# Altium schematic sheet CPU_JTAG_Power_PLL.SchDoc: CPU_JTAG_Power_PLL
size A4 portrait; Revision: 3.4; SheetNumber: 13; SheetTotal: 23; Date: 18/06/2014; DrawnBy: J. Gabriel R.E.; Organization: Seven Solutions S.L.; Address1: C/Baza, Parcela 19, Nave 3; Address2: Polнgono Ind. Juncaril; Address3: 18210-Peligros-Granada; Address4: Spain; WebAddress: www.sevensols.com; Project: White Rabbit; ProjectName: White Rabbit
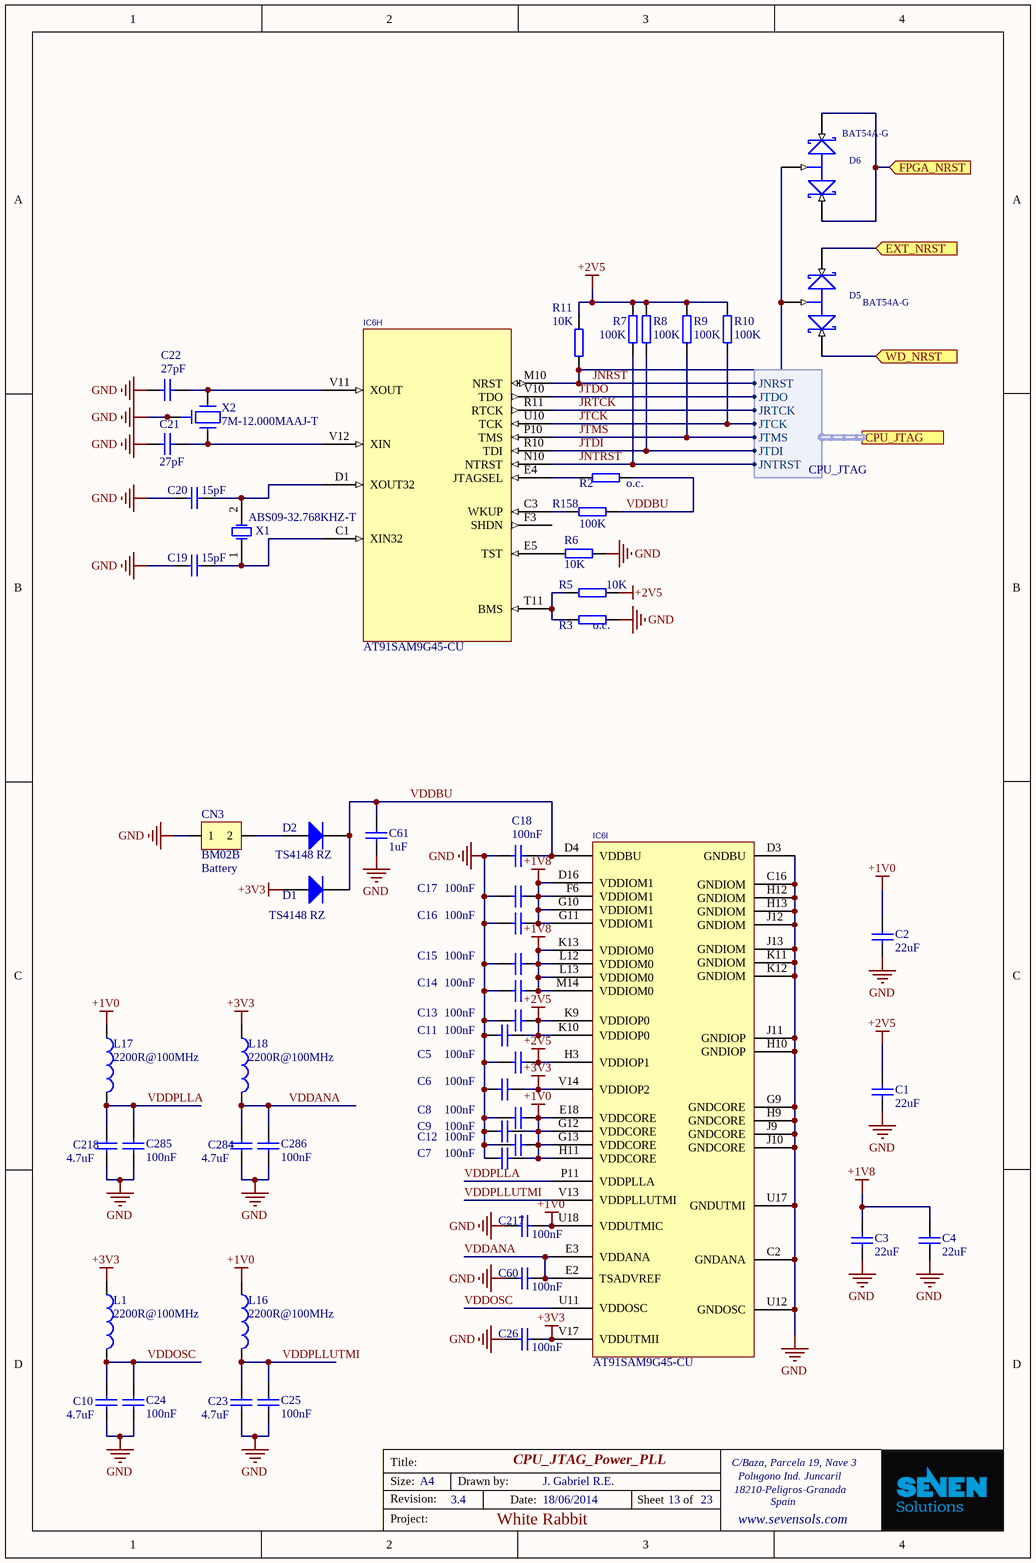
[diagram p0: CPU_JTAG_Power_PLL.SchDoc]

## Parts
C1  22uF  [CC2012-0805]
C2  22uF  [CC2012-0805]
C3  22uF  [CC2012-0805]
C4  22uF  [CC2012-0805]
C5  100nF  [CC1005-0402]
C6  100nF  [CC1005-0402]
C7  100nF  [CC1005-0402]
C8  100nF  [CC1005-0402]
C9  100nF  [CC1005-0402]
C10  4.7uF  [CC1608-0603]
C11  100nF  [CC1005-0402]
C12  100nF  [CC1005-0402]
C13  100nF  [CC1005-0402]
C14  100nF  [CC1005-0402]
C15  100nF  [CC1005-0402]
C16  100nF  [CC1005-0402]
C17  100nF  [CC1005-0402]
C18  100nF  [CC1005-0402]
C19  15pF  [CC1005-0402]
C20  15pF  [CC1005-0402]
C21  27pF  [CC1005-0402]
C22  27pF  [CC1005-0402]
C23  4.7uF  [CC1608-0603]
C24  100nF  [CC1005-0402]
C25  100nF  [CC1005-0402]
C26  100nF  [CC1005-0402]
C60  100nF  [CC1005-0402]
C61  1uF  [CC1005-0402]
C217  100nF  [CC1005-0402]
C218  4.7uF  [CC1608-0603]
C284  4.7uF  [CC1608-0603]
C285  100nF  [CC1005-0402]
C286  100nF  [CC1005-0402]
CN3  BM02B  Comment2: Battery  [SH_CRIMP_1MM_2]
D1  TS4148 RZ  [CD1608-0603]
D2  TS4148 RZ  [CD1608-0603]
D5  BAT54A-G  [SOT23]
D6  BAT54A-G  [SOT23]
IC6  AT91SAM9G45-CU  [TFBGA324]  (parts H,I of 12)
L1  Impedance: 2200R@100MHz  [0805]  (hidden comment: 2200R@100MHz Ferrite Bead)
L16  Impedance: 2200R@100MHz  [0805]  (hidden comment: 2200R@100MHz Ferrite Bead)
L17  Impedance: 2200R@100MHz  [0805]  (hidden comment: 2200R@100MHz Ferrite Bead)
L18  Impedance: 2200R@100MHz  [0805]  (hidden comment: 2200R@100MHz Ferrite Bead)
R2  o.c.  [0402]
R3  o.c.  [0402]
R5  10k  [0402]
R6  10k  [0402]
R7  100K  [0402]
R8  100K  [0402]
R9  100K  [0402]
R10  100K  [0402]
R11  10k  [0402]
R158  100K  [0402]
X1  ABS09-32.768KHZ-T  [XTAL_abs09]
X2  7M-12.000MAAJ-T  [OSC_IQD_CFPS-39]

## Ports
CPU_JTAG (harness CPU_JTAG), EXT_NRST (in), FPGA_NRST (in), WD_NRST (in)

## Harnesses
CPU_JTAG: JNRST, JTDO, JRTCK, JTCK, JTMS, JTDI, JNTRST

## Nets
+1V0: C2.2 C7.1 C8.1 C9.1 C12.1 C217.2 IC6.E18(VDDCORE) IC6.G12(VDDCORE) IC6.G13(VDDCORE) IC6.H11(VDDCORE) IC6.U18(VDDUTMIC) L16.1 L17.1
+1V8: C3.2 C4.2 C14.1 C15.1 C16.1 C17.1 IC6.D16(VDDIOM1) IC6.F6(VDDIOM1) IC6.G10(VDDIOM1) IC6.G11(VDDIOM1) IC6.K13(VDDIOM0) IC6.L12(VDDIOM0) IC6.L13(VDDIOM0) IC6.M14(VDDIOM0)
+2V5: C1.2 C5.1 C11.1 C13.1 IC6.H3(VDDIOP1) IC6.K9(VDDIOP0) IC6.K10(VDDIOP0) R5.1 R7.2 R8.2 R9.2 R10.2 R11.2
+3V3: C6.1 C26.2 D1.1(A) IC6.V14(VDDIOP2) IC6.V17(VDDUTMII) L1.1 L18.1
GND: C1.1 C2.1 C3.1 C4.1 C5.2 C6.2 C7.2 C8.2 C9.2 C10.1 C11.2 C12.2 C13.2 C14.2 C15.2 C16.2 C17.2 C18.2 C19.1 C20.1 C21.1 C22.1 C23.1 C24.2 C25.2 C26.1 C60.1 C61.1 C217.1 C218.1 C284.1 C285.2 C286.2 CN3.1 IC6.C2(GNDANA) IC6.C16(GNDIOM) IC6.D3(GNDBU) IC6.G9(GNDCORE) IC6.H9(GNDCORE) IC6.H10(GNDIOP) IC6.H12(GNDIOM) IC6.H13(GNDIOM) IC6.J9(GNDCORE) IC6.J10(GNDCORE) IC6.J11(GNDIOP) IC6.J12(GNDIOM) IC6.J13(GNDIOM) IC6.K11(GNDIOM) IC6.K12(GNDIOM) IC6.U12(GNDOSC) IC6.U17(GNDUTMI) R3.2 R6.1 X2.2 X2.4
EXT_NRST: D5.2(K2) ; port EXT_NRST
FPGA_NRST: D6.1(K1) D6.2(K2) ; port FPGA_NRST
JNRST: D5.3(A) D6.3(A) IC6.M10(NRST) R11.1 ; port CPU_JTAG.JNRST
JNTRST: IC6.N10(NTRST) R7.1 ; port CPU_JTAG.JNTRST
JRTCK: IC6.R11(RTCK) ; port CPU_JTAG.JRTCK
JTCK: IC6.U10(TCK) R10.1 ; port CPU_JTAG.JTCK
JTDI: IC6.R10(TDI) R8.1 ; port CPU_JTAG.JTDI
JTDO: IC6.V10(TDO) ; port CPU_JTAG.JTDO
JTMS: IC6.P10(TMS) R9.1 ; port CPU_JTAG.JTMS
VDDANA: C60.2 C284.2 C286.1 IC6.E2(TSADVREF) IC6.E3(VDDANA) L18.2
VDDBU: C18.1 C61.2 D1.2(K) D2.2(K) IC6.D4(VDDBU) R2.2 R158.2
VDDOSC: C10.2 C24.1 IC6.U11(VDDOSC) L1.2
VDDPLLA: C218.2 C285.1 IC6.P11(VDDPLLA) L17.2
VDDPLLUTMI: C23.2 C25.1 IC6.V13(VDDPLLUTMI) L16.2
WD_NRST: D5.1(K1) ; port WD_NRST
NetC19_2: C19.2 IC6.C1(XIN32) X1.1(OSC1)
NetC20_2: C20.2 IC6.D1(XOUT32) X1.2(OSC2)
NetC21_2: C21.2 IC6.V12(XIN) X2.3
NetC22_2: C22.2 IC6.V11(XOUT) X2.1
NetCN3_2: CN3.2 D2.1(A)
NetIC6_C3: IC6.C3(WKUP) R158.1
NetIC6_E4: IC6.E4(JTAGSEL) R2.1
NetIC6_E5: IC6.E5(TST) R6.2
NetIC6_T11: IC6.T11(BMS) R3.1 R5.2

Not connected (* = marked no-connect by the designer): IC6 F3(SHDN)

## Notes on the sheet
- Title:
- Size:
- Revision:
- A4
- Drawn by:
- Date:
- Sheet
- of
- Project:

## Library data of the parts
C1-C4 = CC0805_22UF_6.3V_20%_X5R: Capacitor; Manufacturer1: TDK; Manufacturer1 PN: C2012X5R0J226M; TC: X5R; Tolerance: ±20%; Voltage: 6.3V; Published: 8-Jun-2000; LatestRevisionDate: 17-Jul-2002; LatestRevisionNote: Re-released for DXP Platform.; PackageReference: RAD-0.3; Publisher: Altium Limited; Distributor1: Digikey; Distributor1 PN: 445-1422-1-ND; Case: 0805; Value: 22uF
C5-C9 C11-C18 C24-C26 C60 C217 C285 C286 = CC0402_100NF_16V_10%_X7R: Capacitor; Manufacturer1: TDK; Manufacturer1 PN: C1005X7R1C104K; TC: X7R; Tolerance: ±10%; Voltage: 16V; Published: 8-Jun-2000; LatestRevisionDate: 17-Jul-2002; LatestRevisionNote: Re-released for DXP Platform.; PackageReference: RAD-0.3; Publisher: Altium Limited; Distributor1: Digikey; Distributor1 PN: 445-4952-1-ND; Case: 0402; Value: 100nF
C10 C23 C218 C284 = CC0603_4.7UF_10V_10%_X5R: Capacitor; Manufacturer1: TDK; Manufacturer1 PN: C1608X5R1A475K; TC: X5R; Tolerance: ±10%; Voltage: 10V; Published: 8-Jun-2000; LatestRevisionDate: 17-Jul-2002; LatestRevisionNote: Re-released for DXP Platform.; PackageReference: RAD-0.3; Publisher: Altium Limited; Distributor1: Digikey; Distributor1 PN: 445-5170-1-ND; Case: 0603; Value: 4.7uF
C19 C20 = CC0402_15PF_50V_5%_NP0: Capacitor; Manufacturer1: TDK; Manufacturer1 PN: C1005C0G1H150J; TC: NP0; Tolerance: ±5%; Voltage: 50V; Published: 8-Jun-2000; LatestRevisionDate: 17-Jul-2002; LatestRevisionNote: Re-released for DXP Platform.; PackageReference: RAD-0.3; Publisher: Altium Limited; Distributor1: Digikey; Distributor1 PN: 445-1237-1-ND; Case: 0402; Value: 15pF
C21 C22 = CC0402_27PF_50V_5%_NP0: Capacitor; Manufacturer1: TDK; Manufacturer1 PN: C1005C0G1H270J; TC: NP0; Tolerance: ±5%; Voltage: 50V; Published: 8-Jun-2000; LatestRevisionDate: 17-Jul-2002; LatestRevisionNote: Re-released for DXP Platform.; PackageReference: RAD-0.3; Publisher: Altium Limited; Distributor1: Digikey; Distributor1 PN: 445-1240-1-ND; Case: 0402; Value: 27pF
C61 = CC0402_1UF_16V_10%_X5R: Capacitor; Manufacturer1: TDK; Manufacturer1 PN: C1005X5R1C105K; TC: X5R; Tolerance: ±10%; Voltage: 16V; Published: 8-Jun-2000; LatestRevisionDate: 17-Jul-2002; LatestRevisionNote: Re-released for DXP Platform.; PackageReference: RAD-0.3; Publisher: Altium Limited; Distributor1: Digikey; Distributor1 PN: 445-4978-1-ND; Case: 0402; Value: 1uF
CN3 = CON_SH_CRIMP_1MM_2: Manufacturer1: Japan Solderless Terminals; Manufacturer1 PN: BM02B-SRSS-TB(LF)(SN); Distributor1 PN: 1679127; Distributor1: Farnell
D1 D2 = Diode: Default Diode; Published: 8-Jun-2000; LatestRevisionDate: 17-Jul-2002; LatestRevisionNote: Re-released for DXP Platform.; PackageDocument: Sep-1996; PackageReference: SMC; Publisher: Altium Limited; Code_JEDEC: DO-214-AB; Value: TS4148 RZ; Distributor1 PN: 8150192; Distributor1: Farnell
D5 D6 = BAT54A.1: Schottky Barrier Double Diode; PACKAGE_INFORMATION: Latest Revision: May-1999; DEVICE: BAT54A-G; PKG_TYPE: SOT23; PUBLISHED: 17-Sep-2003; DATASHEET: Latest Revision: 4-Mar-2002; PACKAGE_REFERENCE: SOT23; PUBLISHER: Altium Limited; Value: BAT54A-G; Distributor1 PN: 641-1319-1-ND; Distributor1: Digikey
IC6 = AT91SAM9G45-CU: Atmel 400MHz ARM926 MCU; Value: AT91SAM9G45-CU; Distributor1 PN: AT91SAM9G45-CU-ND; Distributor1: Digikey
L1 L16-L18 = L_FERRITE_BEAD: ferrite bead; Manufacturer1: Wurth Electronics; Manufacturer1 PN: 742792093; Current Rating: 0.2A; DCR: 600mOhm; Case: 0805; Distributor1: Digikey; Distributor1 PN: 732-1609-1-ND
R2 R3 = R0402_O.C.: SMD Resistor; Mounted: No; Case: 0402; Manufacturer1: N/A; Manufacturer1 PN: N/A; Distributor1: N/A; Distributor1 PN: N/A; TCR: N/A; Power Rating: N/A; Tolerance: N/A; Value: o.c.
R5 R6 R11 = R0402_10K_±1%_0.1W_100PPM: SMD Resistor; Manufacturer1: Panasonic; Manufacturer1 PN: ERJ-2RKF1002X; TCR: 100ppm; Power Rating: 0.1W; Tolerance: ±1%; Case: 0402; Distributor1: DigiKey; Distributor1 PN: P10.0KLCT-ND; Value: 10K
R7-R10 R158 = R0402_100K_±1%_0.1W_100PPM: SMD Resistor; Manufacturer1: Panasonic; Manufacturer1 PN: ERJ-2RKF1003X; TCR: 100ppm; Power Rating: 0.1W; Tolerance: ±1%; Case: 0402; Distributor1: DigiKey; Distributor1 PN: P100KLCT-ND; Value: 100K
X1 = XTAL: Crystal Oscillator 12pF; Manufacturer: Raltron; Published: 8-Jun-2000; LatestRevisionDate: 17-Jul-2002; LatestRevisionNote: Re-released for DXP Platform.; PackageReference: R38; Publisher: Altium Limited; Value: ABS09-32.768KHZ-T; Distributor1: Farnell; Distributor1 PN: 1633671
X2 = X_CRYSTAL_SMD_7M: SMD Crystal 7M Series 18pF 30 ppm; Value: 7M-12.000MAAJ-T; Distributor1 PN: 887-1121-1-ND; Distributor1: Digikey